# Altium schematic sheet Mother_Board.SchDoc
size 594 x 420 mm; SheetNumber: 1; SheetTotal: 1
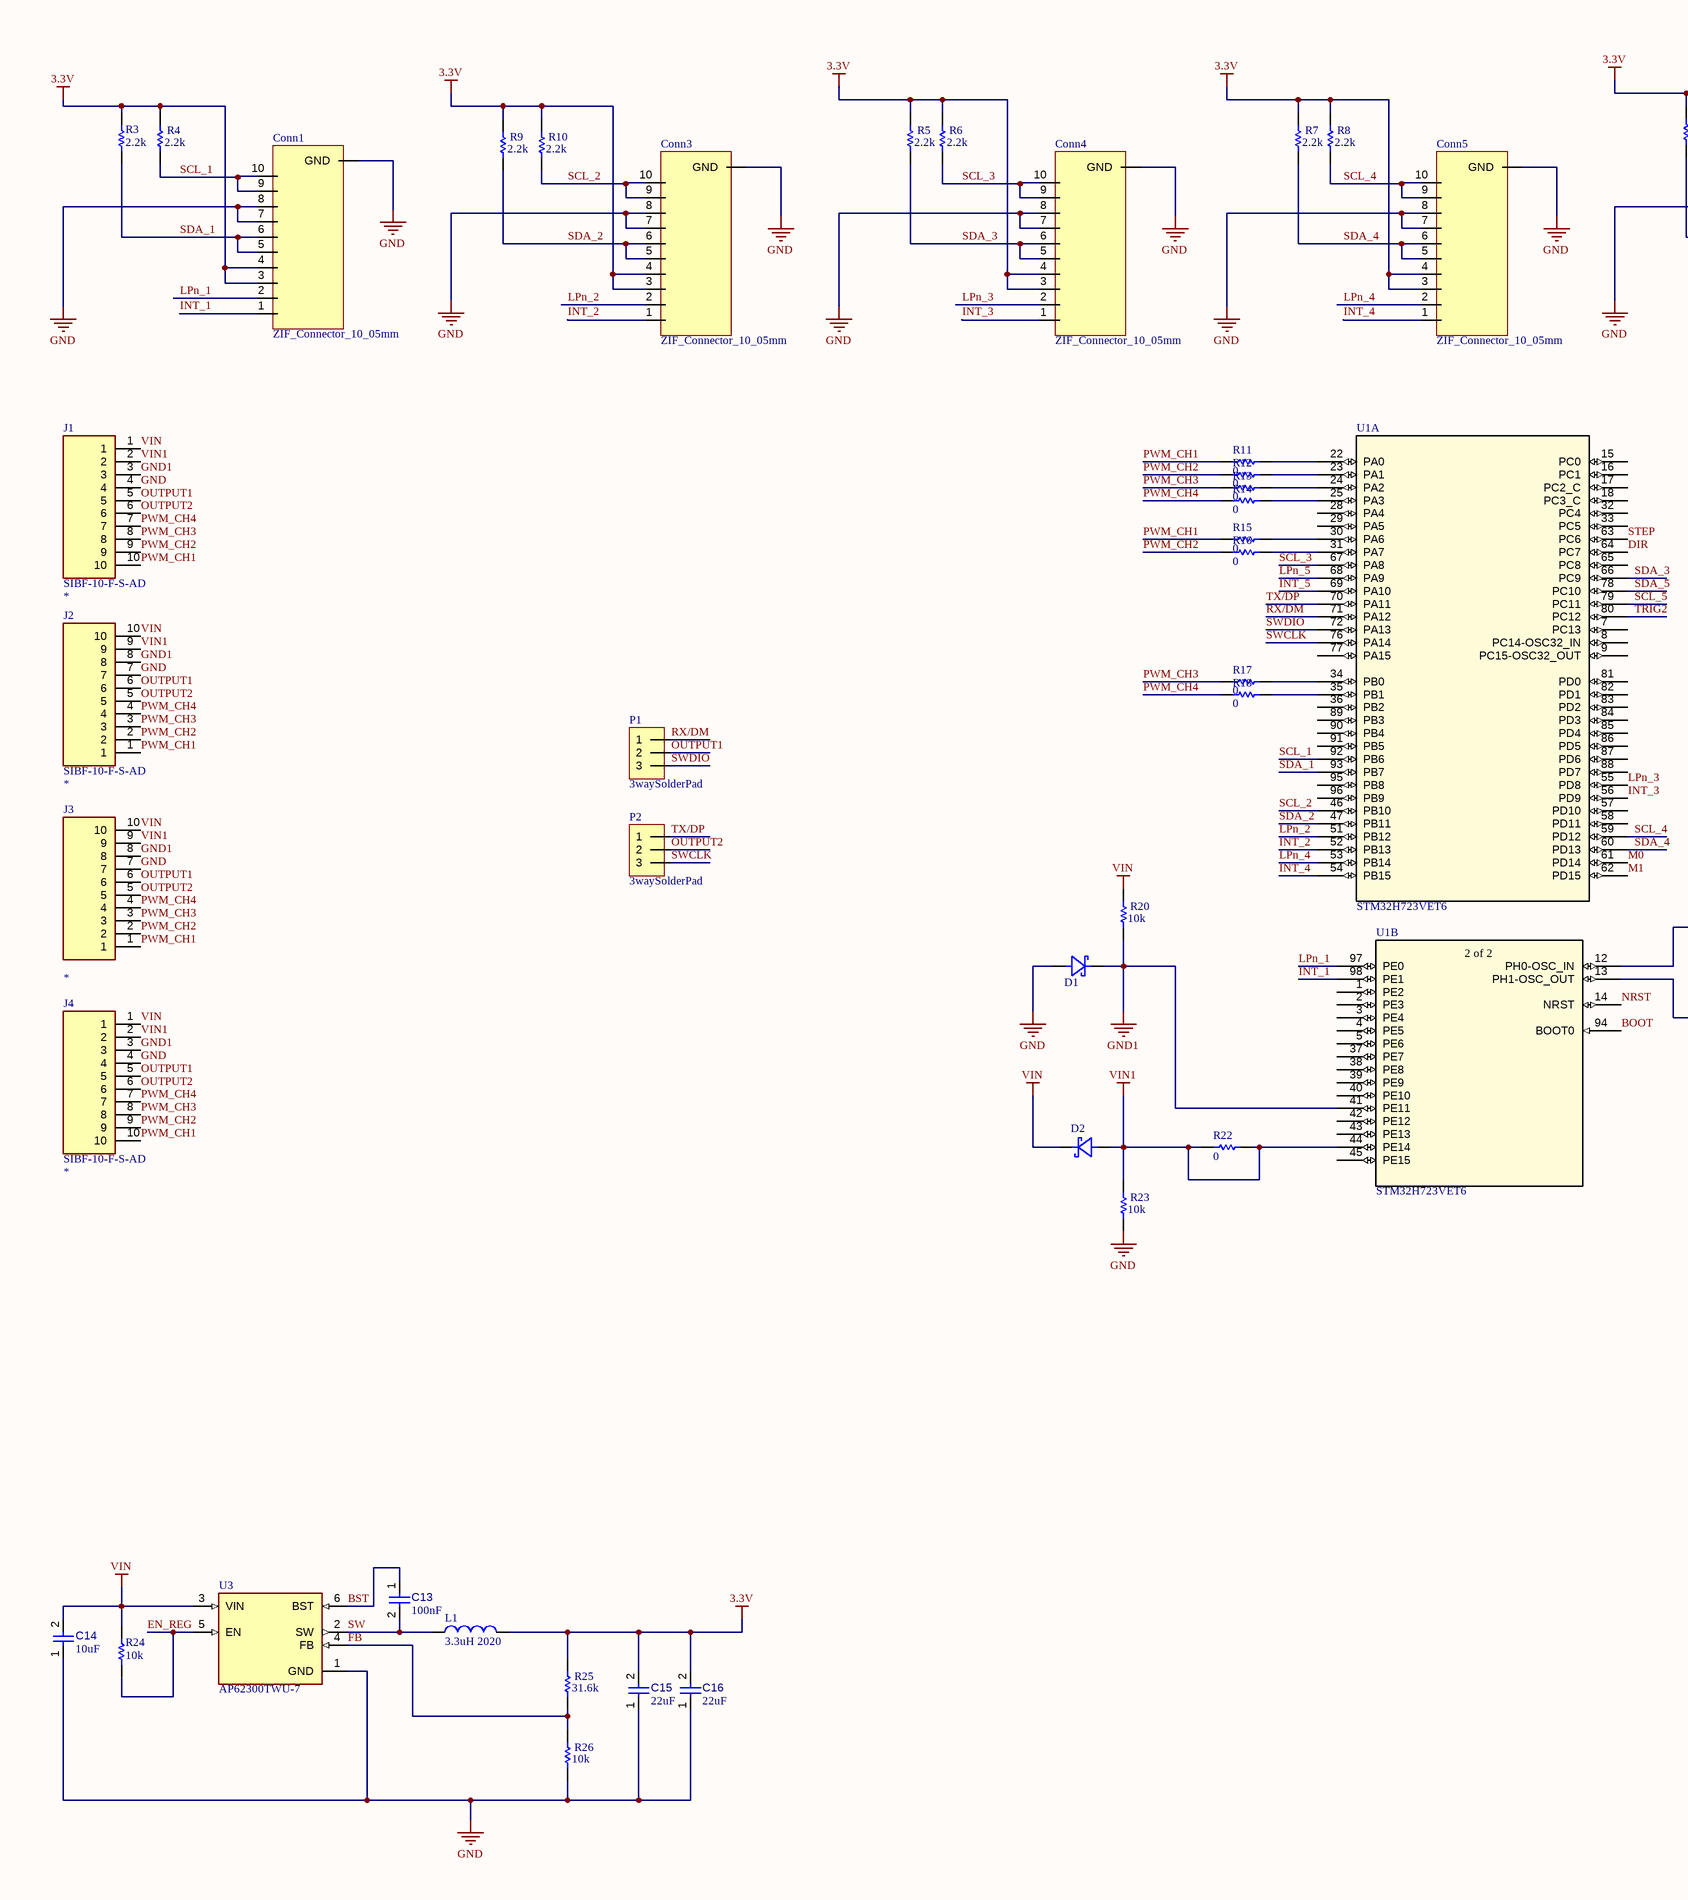
[diagram p0: Mother_Board.SchDoc, left]
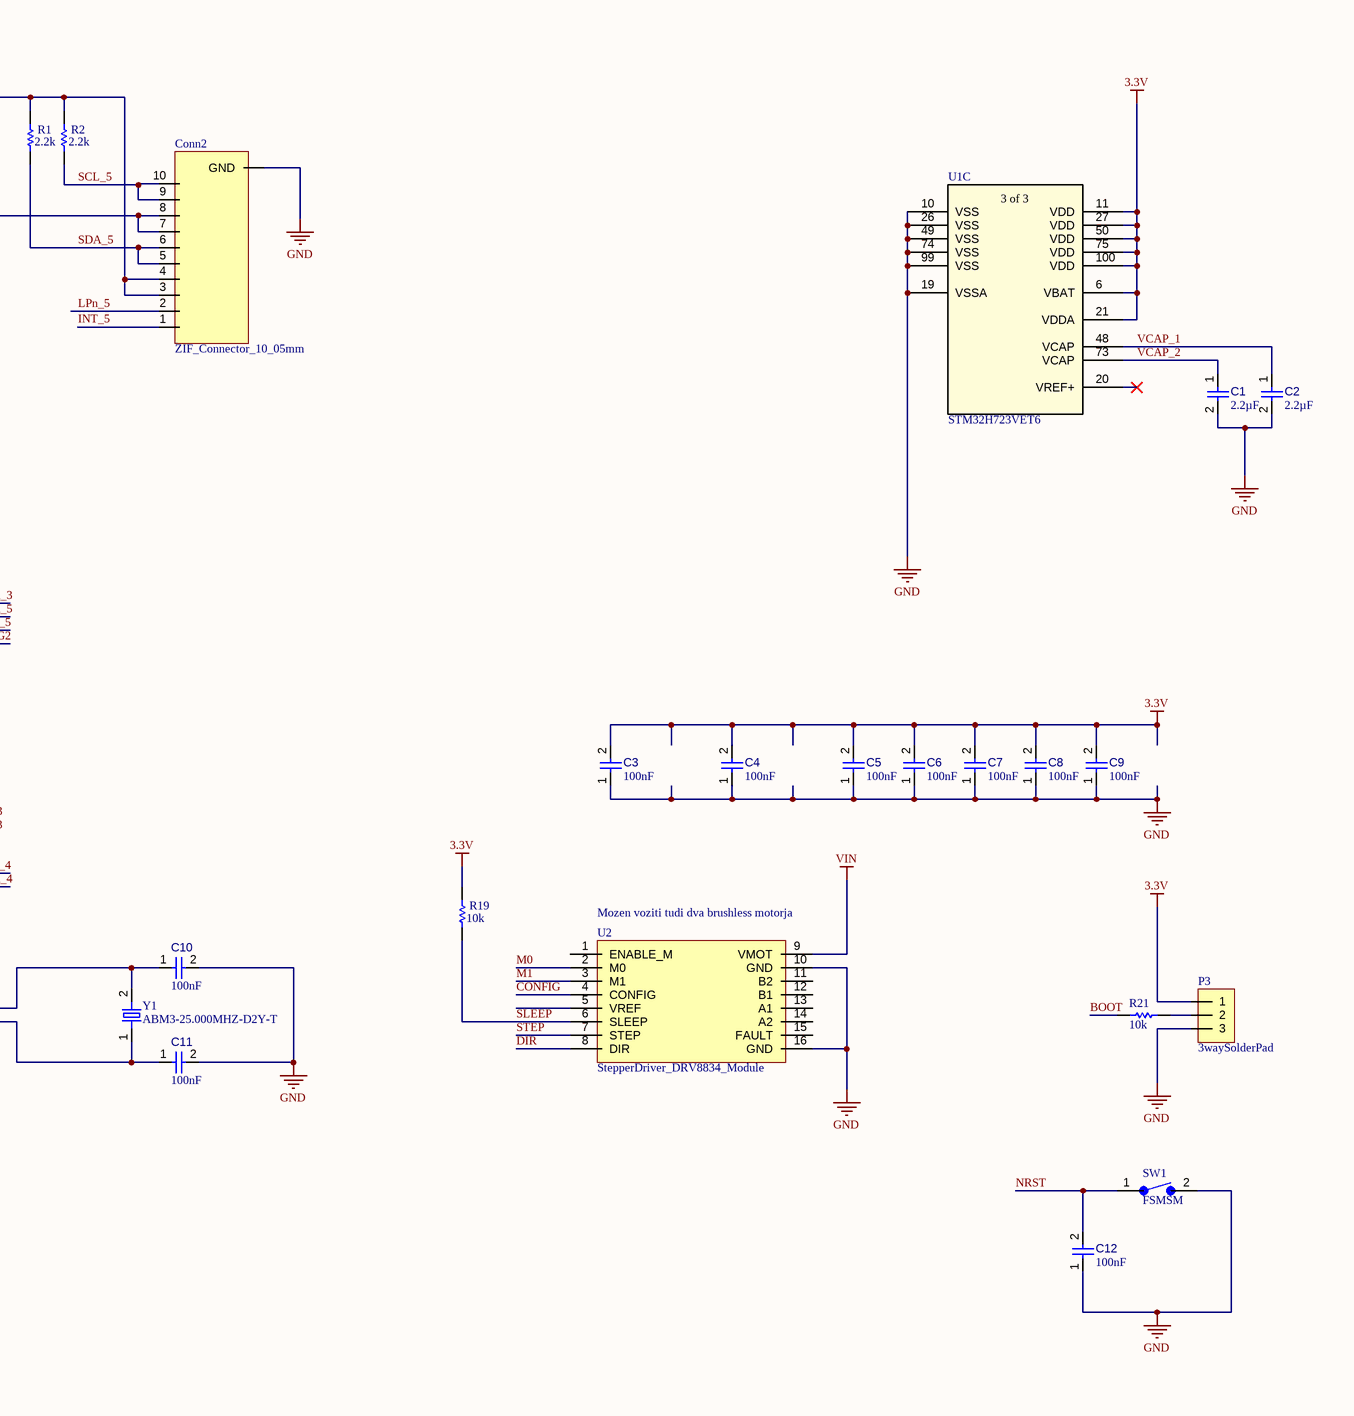
[diagram p1: Mother_Board.SchDoc, right]

## Parts
C1  value 2.2µF  [CAPC0603(1608)100_L]  (hidden comment: Capacitor 4.7µF +/-20% 10V 0603)
C2  value 2.2µF  [CAPC0603(1608)100_L]  (hidden comment: Capacitor 4.7µF +/-20% 10V 0603)
C3  value 100nF  [CAPC0402(1005)60_L]  (hidden comment: Capacitor 100nF +/-20% 25V 0402)
C4  value 100nF  [CAPC0402(1005)60_L]  (hidden comment: Capacitor 100nF +/-20% 25V 0402)
C5  value 100nF  [CAPC0402(1005)60_L]  (hidden comment: Capacitor 100nF +/-20% 25V 0402)
C6  value 100nF  [CAPC0402(1005)60_L]  (hidden comment: Capacitor 100nF +/-20% 25V 0402)
C7  value 100nF  [CAPC0402(1005)60_L]  (hidden comment: Capacitor 100nF +/-20% 25V 0402)
C8  value 100nF  [CAPC0402(1005)60_L]  (hidden comment: Capacitor 100nF +/-20% 25V 0402)
C9  value 100nF  [CAPC0402(1005)60_L]  (hidden comment: Capacitor 100nF +/-20% 25V 0402)
C10  value 100nF  [CAPC1608X90X40NL10T20]  (hidden comment: Capacitor 100 nF +/-10% 50 V 0603)
C11  value 100nF  [CAPC1608X90X40NL10T20]  (hidden comment: Capacitor 100 nF +/-10% 50 V 0603)
C12  value 100nF  [CAPC0402(1005)60_L]  (hidden comment: Capacitor 100nF +/-20% 25V 0402)
C13  value 100nF  [CAPC1608X90X40NL10T20]  (hidden comment: Capacitor 100 nF +/-10% 50 V 0603)
C14  value 10uF  [CAPC3216X180X50NL20T25]  (hidden comment: Capacitor 10 uF +/- 10% 16 V 1206)
C15  value 22uF  [CAPC3216X180X50NL20T25]  (hidden comment: Capacitor 10 uF +/- 10% 16 V 1206)
C16  value 22uF  [CAPC3216X180X50NL20T25]  (hidden comment: Capacitor 10 uF +/- 10% 16 V 1206)
Conn1  ZIF_Connector_10_05mm  [ZIF_Connector_10_05mm]
Conn2  ZIF_Connector_10_05mm  [ZIF_Connector_10_05mm]
Conn3  ZIF_Connector_10_05mm  [ZIF_Connector_10_05mm]
Conn4  ZIF_Connector_10_05mm  [ZIF_Connector_10_05mm]
Conn5  ZIF_Connector_10_05mm  [ZIF_Connector_10_05mm]
D1  PMEG3030BEP,115  [CFP5_SOD128_NEX]  (value not drawn)
D2  PMEG3030BEP,115  [CFP5_SOD128_NEX]  (value not drawn)
J1  SIBF-10-F-S-AD  [SAMTEC_SIBF-10-F-S-AD]
J2  SIBF-10-F-S-AD  [SAMTEC_SIBF-10-F-S-AD]
J3  (no value)  [SAMTEC_SIBF-10-F-S-AD]
J4  SIBF-10-F-S-AD  [SAMTEC_SIBF-10-F-S-AD]
L1  3.3uH 2020  [IHLP-2020CZ-11]
P1  3waySolderPad  [3waySolderPad]
P2  3waySolderPad  [3waySolderPad]
P3  3waySolderPad  [3waySolderPad]
R1  value 2.2k  [RESC1608X55X25NL10T15]  (hidden comment: Resistor 0R +/- 5% 0603 100 mW)
R2  value 2.2k  [RESC1608X55X25NL10T15]  (hidden comment: Resistor 0R +/- 5% 0603 100 mW)
R3  value 2.2k  [RESC1608X55X25NL10T15]  (hidden comment: Resistor 0R +/- 5% 0603 100 mW)
R4  value 2.2k  [RESC1608X55X25NL10T15]  (hidden comment: Resistor 0R +/- 5% 0603 100 mW)
R5  value 2.2k  [RESC1608X55X25NL10T15]  (hidden comment: Resistor 0R +/- 5% 0603 100 mW)
R6  value 2.2k  [RESC1608X55X25NL10T15]  (hidden comment: Resistor 0R +/- 5% 0603 100 mW)
R7  value 2.2k  [RESC1608X55X25NL10T15]  (hidden comment: Resistor 0R +/- 5% 0603 100 mW)
R8  value 2.2k  [RESC1608X55X25NL10T15]  (hidden comment: Resistor 0R +/- 5% 0603 100 mW)
R9  value 2.2k  [RESC1608X55X25NL10T15]  (hidden comment: Resistor 0R +/- 5% 0603 100 mW)
R10  value 2.2k  [RESC1608X55X25NL10T15]  (hidden comment: Resistor 0R +/- 5% 0603 100 mW)
R11  value 0  [RESC1005X40X25ML05T05]  (hidden comment: Resistor 0R +/- 5% 0402 100 mW)
R12  value 0  [RESC1005X40X25ML05T05]  (hidden comment: Resistor 0R +/- 5% 0402 100 mW)
R13  value 0  [RESC1005X40X25ML05T05]  (hidden comment: Resistor 0R +/- 5% 0402 100 mW)
R14  value 0  [RESC1005X40X25ML05T05]  (hidden comment: Resistor 0R +/- 5% 0402 100 mW)
R15  value 0  [RESC1005X40X25ML05T05]  (hidden comment: Resistor 0R +/- 5% 0402 100 mW)
R16  value 0  [RESC1005X40X25ML05T05]  (hidden comment: Resistor 0R +/- 5% 0402 100 mW)
R17  value 0  [RESC1005X40X25ML05T05]  (hidden comment: Resistor 0R +/- 5% 0402 100 mW)
R18  value 0  [RESC1005X40X25ML05T05]  (hidden comment: Resistor 0R +/- 5% 0402 100 mW)
R19  value 10k  [RESC1608X55X25NL10T15]  (hidden comment: Resistor 0R +/- 5% 0603 100 mW)
R20  value 10k  [RESC1608X55X25NL10T15]  (hidden comment: Resistor 0R +/- 5% 0603 100 mW)
R21  value 10k  [RESC1608X55X25ML10T15]  (hidden comment: Resistor 10kR +/- 5% 0603 100 mW)
R22  value 0  [RESC1005X40X25ML05T05]  (hidden comment: Resistor 0R +/- 5% 0402 100 mW)
R23  value 10k  [RESC1608X55X25NL10T15]  (hidden comment: Resistor 0R +/- 5% 0603 100 mW)
R24  value 10k  [RESC1608X55X25ML10T15]  (hidden comment: Resistor 10kR +/- 5% 0603 100 mW)
R25  value 31.6k  [RESC1608X55X25NL10T15]  (hidden comment: Resistor 0R +/- 5% 0603 100 mW)
R26  value 10k  [RESC1608X55X25NL10T15]  (hidden comment: Resistor 0R +/- 5% 0603 100 mW)
SW1  FSMSM  [TE_FSMSM]
U1  STM32H723VET6  [LQFP100_STM]  (parts A,B,C of 3)
U2  StepperDriver_DRV8834_Module  [StepperDriver_DRV8834_Module]
U3  AP62300TWU-7  [SOT95P280X100-6N]
Y1  ABM3-25.000MHZ-D2Y-T  [XTAL500X320X130N]

## Nets
3.3V: C3.2 C4.2 C5.2 C6.2 C7.2 C8.2 C9.2 C15.2 C16.2 Conn1.3 Conn1.4 Conn2.3 Conn2.4 Conn3.3 Conn3.4 Conn4.3 Conn4.4 Conn5.3 Conn5.4 L1.P$2 P3.1 R1.1 R2.1 R3.1 R4.1 R5.1 R6.1 R7.1 R8.1 R9.1 R10.1 R19.1 R25.1 U1.6(VBAT) U1.11(VDD) U1.21(VDDA) U1.27(VDD) U1.50(VDD) U1.75(VDD) U1.100(VDD)
GND: C1.2 C2.2 C3.1 C4.1 C5.1 C6.1 C7.1 C8.1 C9.1 C10.2 C11.2 C12.1 C14.1 C15.1 C16.1 Conn1.7 Conn1.8 Conn1.GND Conn2.7 Conn2.8 Conn2.GND Conn3.7 Conn3.8 Conn3.GND Conn4.7 Conn4.8 Conn4.GND Conn5.7 Conn5.8 Conn5.GND D1.2 J1.4 J2.7 J3.7 J4.4 P3.3 R23.2 R26.2 SW1.2 U1.10(VSS) U1.19(VSSA) U1.26(VSS) U1.49(VSS) U1.74(VSS) U1.99(VSS) U2.10(GND) U2.16(GND) U3.1(GND)
GND1: D1.1 J1.3 J2.8 J3.8 J4.3 R20.2 U1.41(PE11)
VIN: C14.2 D2.1 J1.1 J2.10 J3.10 J4.1 R20.1 R24.2 U2.9(VMOT) U3.3(VIN)
VIN1: D2.2 J1.2 J2.9 J3.9 J4.2 R22.1 R22.2 R23.1 U1.44(PE14)
BOOT: R21.1 U1.94(BOOT0)
BST: C13.1 U3.6(BST)
CONFIG: U2.4(CONFIG)
DIR: U1.64(PC7) U2.8(DIR)
EN_REG: R24.1 U3.5(EN)
FB: R25.2 R26.1 U3.4(FB)
INT_1: Conn1.1 U1.98(PE1)
INT_2: Conn3.1 U1.52(PB13)
INT_3: Conn4.1 U1.56(PD9)
INT_4: Conn5.1 U1.54(PB15)
INT_5: Conn2.1 U1.69(PA10)
LPn_1: Conn1.2 U1.97(PE0)
LPn_2: Conn3.2 U1.51(PB12)
LPn_3: Conn4.2 U1.55(PD8)
LPn_4: Conn5.2 U1.53(PB14)
LPn_5: Conn2.2 U1.68(PA9)
M0: U1.61(PD14) U2.2(M0)
M1: U1.62(PD15) U2.3(M1)
NRST: C12.2 SW1.1 U1.14(NRST)
OUTPUT1: J1.5 J2.6 J3.6 J4.5 P1.2
OUTPUT2: J1.6 J2.5 J3.5 J4.6 P2.2
PWM_CH1: J1.10 J2.1 J3.1 J4.10 R11.1 R15.1
PWM_CH2: J1.9 J2.2 J3.2 J4.9 R12.1 R16.1
PWM_CH3: J1.8 J2.3 J3.3 J4.8 R13.1 R17.1
PWM_CH4: J1.7 J2.4 J3.4 J4.7 R14.1 R18.1
RX/DM: P1.1 U1.71(PA12)
SCL_1: Conn1.9 Conn1.10 R4.2 U1.92(PB6)
SCL_2: Conn3.9 Conn3.10 R10.2 U1.46(PB10)
SCL_3: Conn4.9 Conn4.10 R6.2 U1.67(PA8)
SCL_4: Conn5.9 Conn5.10 R8.2 U1.59(PD12)
SCL_5: Conn2.9 Conn2.10 R2.2 U1.79(PC11)
SDA_1: Conn1.5 Conn1.6 R3.2 U1.93(PB7)
SDA_2: Conn3.5 Conn3.6 R9.2 U1.47(PB11)
SDA_3: Conn4.5 Conn4.6 R5.2 U1.66(PC9)
SDA_4: Conn5.5 Conn5.6 R7.2 U1.60(PD13)
SDA_5: Conn2.5 Conn2.6 R1.2 U1.78(PC10)
SLEEP: R19.2 U2.6(SLEEP)
STEP: U1.63(PC6) U2.7(STEP)
SW: C13.2 L1.P$1 U3.2(SW)
SWCLK: P2.3 U1.76(PA14)
SWDIO: P1.3 U1.72(PA13)
TRIG2: U1.80(PC12)
TX/DP: P2.1 U1.70(PA11)
VCAP_1: C2.1 U1.48(VCAP)
VCAP_2: C1.1 U1.73(VCAP)
NetC10_1: C10.1 U1.12(PH0-OSC_IN) Y1.2
NetC11_1: C11.1 U1.13(PH1-OSC_OUT) Y1.1
NetP3_2: P3.2 R21.2
NetR11_2: R11.2 U1.22(PA0)
NetR12_2: R12.2 U1.23(PA1)
NetR13_2: R13.2 U1.24(PA2)
NetR14_2: R14.2 U1.25(PA3)
NetR15_2: R15.2 U1.30(PA6)
NetR16_2: R16.2 U1.31(PA7)
NetR17_2: R17.2 U1.34(PB0)
NetR18_2: R18.2 U1.35(PB1)

Not connected (* = marked no-connect by the designer): U1 1(PE2) 2(PE3) 3(PE4) 4(PE5) 5(PE6) 7(PC13) 8(PC14-OSC32_IN) 9(PC15-OSC32_OUT) 15(PC0) 16(PC1) 17(PC2_C) 18(PC3_C) 20(VREF+)* 28(PA4) 29(PA5) 32(PC4) 33(PC5) 36(PB2) 37(PE7) 38(PE8) 39(PE9) 40(PE10) 42(PE12) 43(PE13) 45(PE15) 57(PD10) 58(PD11) 65(PC8) 77(PA15) 81(PD0) 82(PD1) 83(PD2) 84(PD3) 85(PD4) 86(PD5) 87(PD6) 88(PD7) 89(PB3) 90(PB4) 91(PB5) 95(PB8) 96(PB9); U2 1(ENABLE_M) 5(VREF) 11(B2) 12(B1) 13(A1) 14(A2) 15(FAULT)

## Notes on the sheet
- (near U2) Mozen voziti tudi dva brushless motorja
- DWG NO:
- REV:
- THIS DOCUMENT AND THE DATA DISCLOSED HEREIN OR
- HEREWITH IS THE PROPERTY OF ALTIUM LIMITED AND MAY
- BE FREELY DISTRIBUTED IN WHOLE. NO RIGHTS ARE
- RESERVED OR EXPRESS OR IMPLIED WARANTEE GIVEN.
- REVISION
- DESCRIPTION
- DATE
- APPROVED
- ENG:
- APPROVALS
- PROJECT
- DSN:
- CHK:
- REFERENCE DOCUMENTS
- PROJECT REVISION:
- TITLE
- DOCUMENT REVISION:
- DESIGN ITEM:
- BOM:
- FAB DWG:
- PCB DWG:
- ASSY DWG:
- SCALE:
- A2
- SIZE
- CAGE CODE
- FILE NAME
- DWG NO.
- SHEET
- OF
- REV
- (in symbol STM32H723VET6, part B) 2 of 2
- (in symbol STM32H723VET6, part C) 3 of 3

## Library data of the parts
C1 C2 = CMP-001-00076-3: Chip Capacitor, 4.7µF +/-20%, 10V, 0603, Thickness 1 mm; Tolerance: 10%; Mounting Technology: SMT; Voltage Rating: 10V; Min Operating Temperature: -55°C; Max Operating Temperature: 85°C; Pins: 2; Case/Package: 0603
C3-C9 C12 = CMP-001-00065-3: Chip Capacitor, 100nF +/-20%, 25V, 0402, Thickness 0.6 mm; Tolerance: 10%; Max Operating Temperature: 85°C; Pins: 2; Mounting Technology: SMT; Min Operating Temperature: -55°C; Case/Package: 0402; Voltage Rating: 25V
C10 C11 C13 = CMP-001-00017-5: Chip Capacitor, 100 nF, +/- 10%, 50 V, 0603 (1608 Metric); Voltage Rating: 50V; Capacitor Type: Ceramic; Mounting Technology: SM; Case/Package: 0603; Tolerance: 10%; Max Operating Temperature: 125°C; Min Operating Temperature: -55°C; Pins: 2; RoHS Compliant: True
C14-C16 = CMP-001-00016-5: Chip Capacitor, 22 uF, +/- 10%, 16 V, 1206 (3216 Metric); Voltage Rating: 16V; Capacitor Type: Ceramic; Mounting Technology: SM; RoHS Compliant: True; Tolerance: 10%; Min Operating Temperature: -55°C; Case/Package: 1206; Max Operating Temperature: 125°C; Pins: 2
D1 D2 = PMEG3030BEP,115: MF: {'manufacturer': u'Nexperia USA'}; Value: *; Availability: Unavailable; Package: None; Price: None; MP: PMEG3030BEP,115
J1-J4 = SIBF-10-F-S-AD: MF: {'manufacturer': u'Samtec Inc.'}; Value: *; Availability: Unavailable; MP: SIBF-10-F-S-AD; Price: None; Package: None
L1 = IHLP2020CZER3R3M11: 3.3ÂµH Shielded Molded Inductor 5.5A 40.4mOhm Max Nonstandard; MF: {'manufacturer': u'Vishay Dale'}; Package: None; Availability: Unavailable; Value: *; MP: IHLP2020CZER3R3M11; Price: None
R1-R10 R19 R20 R23 R25 R26 = CMP-009-00006-4: Chip Resistor, 0 Ohm, 0.1 W, -55 to 155 degC, 0603 (1608 Metric); Power: 100mW; Voltage Rating: 50V; Pins: 2; Mounting Technology: SM; Case/Package: 0603; Max Operating Temperature: 155°C; RoHS Compliant: True; Min Operating Temperature: -55°C; Tolerance: 5%
R11-R18 R22 = CMP-009-00005-4: Chip Resistor, 0 Ohm, 0.1 W, -55 to 155 degC, 0402 (1005 Metric); Voltage Rating: 50V; Power: 100mW; Max Operating Temperature: 155°C; Tolerance: 5%; RoHS Compliant: True; Pins: 2; Case/Package: 0402; Min Operating Temperature: -55°C; Mounting Technology: SM
R21 R24 = CMP-009-00006-4: Chip Resistor, 10 kOhm, 0.1 W, -55 to 155 degC, 0603 (1608 Metric); Power: 100mW; Voltage Rating: 50V; Pins: 2; Mounting Technology: SM; Case/Package: 0603; Max Operating Temperature: 155°C; RoHS Compliant: True; Min Operating Temperature: -55°C; Tolerance: 5%
SW1 = FSMSM: Switch Tactile OFF (ON) SPST Rectangular Button Gull Wing 0.05A 12VDC SMD Loose Piece; MF: {'manufacturer': u'TE Connectivity'}; Availability: Unavailable; MP: FSMSM; Package: None; Price: None; Value: *
U1 = STM32H723VET6: No Description Available; Mfr_Name: STMicroelectronics; Copyright: Copyright (C) 2022 Ultra Librarian. All rights reserved.; Manufacturer_Part_Number: STM32H723VET6; RefDes: RefDes; Type: DEV
U3 = AP62300TWU-7: MF: {'manufacturer': u'Diodes Incorporated'}; Value: *; Package: None; Availability: Unavailable; Price: None; MP: AP62300TWU-7
Y1 = ABM3-25.000MHZ-D2Y-T: Crystals 12MHz 18pF 30ppm -40C +85C; MF: {'manufacturer': u'Abracon'}; MP: ABM3-25.000MHZ-D2Y-T; Package: None; Availability: Unavailable; Price: None; Value: *